# EAGLE design countdown (EAGLE 7.1.0)
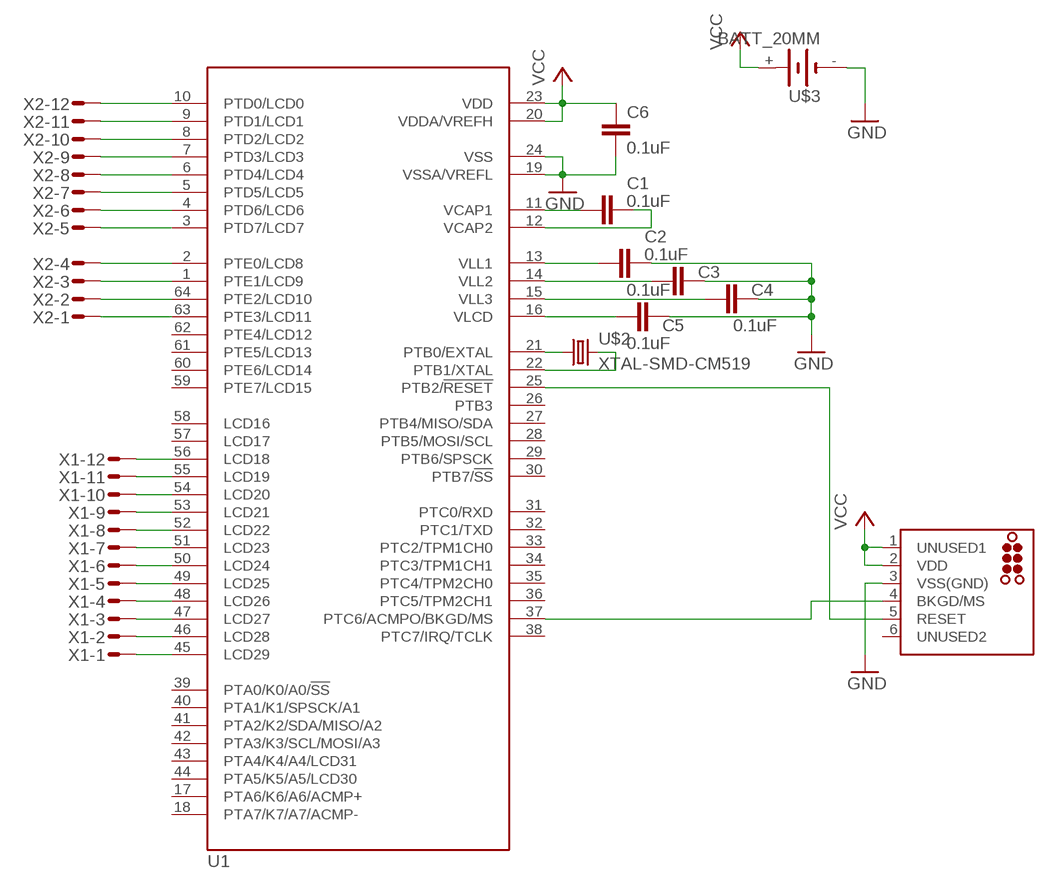
[diagram p0: schematic, sheet 1]

## Parts
BDM  TC2030-MCP-NL  [TC2030-MCP-NL]
C1  0.1uF  C-EUC0603K  [C0603K]
C2  0.1uF  C-EUC0603K  [C0603K]
C3  0.1uF  C-EUC0603K  [C0603K]
C4  0.1uF  C-EUC0603K  [C0603K]
C5  0.1uF  C-EUC0603K  [C0603K]
C6  0.1uF  C-EUC0603K  [C0603K]
U1  MC9S08LL16  [LQFP64]
U$2  XTAL-SMD-CM519  [SMD-XTAL-CM519]
U$3  BATT_20MM  [BATT_20MM]
X1-  HEADER-12-EDGE  [HEADER-12-EDGE]
X2-  HEADER-12-EDGE  [HEADER-12-EDGE]

## Nets
GND: BDM.3(VSS(GND)) C2.1 C3.1 C4.1 C5.1 C6.2 U1.19(VSSA/VREFL) U1.24(VSS) U$3.-
N$1: U1.63(PTE3/LCD11) X2-.1
N$2: U1.64(PTE2/LCD10) X2-.2
N$3: U1.1(PTE1/LCD9) X2-.3
N$4: U1.2(PTE0/LCD8) X2-.4
N$5: U1.3(PTD7/LCD7) X2-.5
N$6: U1.4(PTD6/LCD6) X2-.6
N$7: U1.5(PTD5/LCD5) X2-.7
N$8: U1.6(PTD4/LCD4) X2-.8
N$9: U1.7(PTD3/LCD3) X2-.9
N$10: U1.8(PTD2/LCD2) X2-.10
N$11: U1.9(PTD1/LCD1) X2-.11
N$12: U1.10(PTD0/LCD0) X2-.12
N$13: U1.45(LCD29) X1-.1
N$14: U1.46(LCD28) X1-.2
N$15: U1.47(LCD27) X1-.3
N$16: U1.48(LCD26) X1-.4
N$17: U1.49(LCD25) X1-.5
N$18: U1.50(LCD24) X1-.6
N$19: U1.51(LCD23) X1-.7
N$20: U1.52(LCD22) X1-.8
N$21: U1.53(LCD21) X1-.9
N$22: U1.54(LCD20) X1-.10
N$23: U1.55(LCD19) X1-.11
N$24: U1.56(LCD18) X1-.12
N$31: C1.2 U1.11(VCAP1)
N$32: C1.1 U1.12(VCAP2)
N$33: C2.2 U1.13(VLL1)
N$34: C3.2 U1.14(VLL2)
N$35: C4.2 U1.15(VLL3)
N$36: C5.2 U1.16(VLCD)
N$37: U1.21(PTB0/EXTAL) U$2.P$1
N$38: U1.22(PTB1/XTAL) U$2.P$2
N$39: BDM.4(BKGD/MS) U1.37(PTC6/ACMPO/BKGD/MS)
N$40: BDM.5(RESET) U1.25(PTB2/!RESET)
VCC: BDM.1(UNUSED1) BDM.2(VDD) C6.1 U1.20(VDDA/VREFH) U1.23(VDD) U$3.+
Unconnected: BDM.6(UNUSED2) U1.17(PTA6/K6/A6/ACMP+) U1.18(PTA7/K7/A7/ACMP-) U1.26(PTB3) U1.27(PTB4/MISO/SDA) U1.28(PTB5/MOSI/SCL) U1.29(PTB6/SPSCK) U1.30(PTB7/!SS) U1.31(PTC0/RXD) U1.32(PTC1/TXD) U1.33(PTC2/TPM1CH0) U1.34(PTC3/TPM1CH1) U1.35(PTC4/TPM2CH0) U1.36(PTC5/TPM2CH1) U1.38(PTC7/IRQ/TCLK) U1.39(PTA0/K0/A0/!SS) U1.40(PTA1/K1/SPSCK/A1) U1.41(PTA2/K2/SDA/MISO/A2) U1.42(PTA3/K3/SCL/MOSI/A3) U1.43(PTA4/K4/A4/LCD31) U1.44(PTA5/K5/A5/LCD30) U1.57(LCD17) U1.58(LCD16) U1.59(PTE7/LCD15) U1.60(PTE6/LCD14) U1.61(PTE5/LCD13) U1.62(PTE4/LCD12)

## Library data of the parts
BDM = scott:TC2030: TAG-CONNECT ISP Connector Manufacturer: Tag-Connect <www.tag-connect.com> Cable for easy In-Circuit PCB Programming. Designed for Microchip ICD2, suitable for many others. Two variants - one "with legs" (for hads-free fit on PCB) and another "without legs" for quick programming. PAD Description 1 MCLR/Vpp 2 Vdd 3 GND 4 PGD (ISPDAT) 5 PGC (ISPCLK) 6 nc (used for LVP) ©2009 ROFA.cz
C1-C6 = rcl:C-EU: CAPACITOR, European symbol
U1 = scott:MC9S08LL16
U$2 = scott:XTAL-SMD-CM519
U$3 = scott:BATT_20MM
X1- X2- = scott:HEADER-12-EDGE

## Board
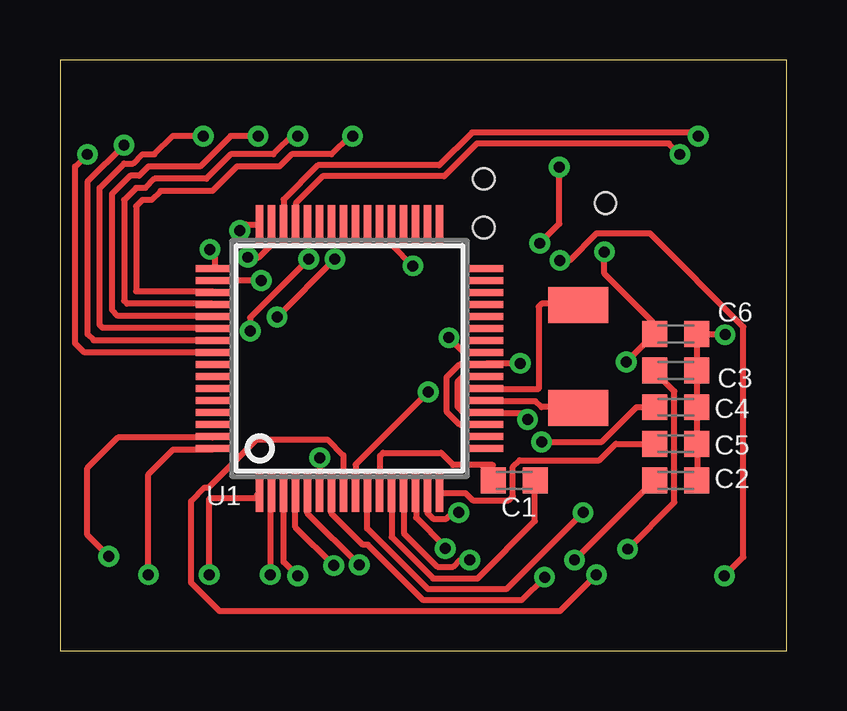
[diagram p1: board, top side]
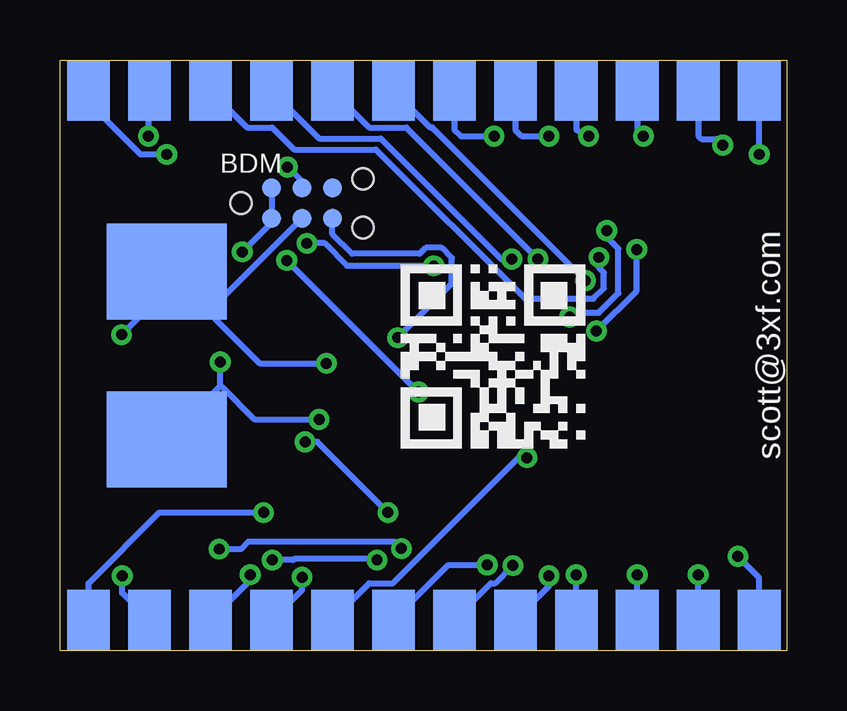
[diagram p2: board, bottom side, seen from below]

Size 30.28 x 24.63 mm. Coordinates in mm from the lower left corner, seen from the top.
Outline: 0,0 30.28,0 30.28,24.63 0,24.63 0,0
Copper layers (1*16): Top 0.035mm / dielectric 1.5mm / Bottom 0.035mm
Design rules "default *": minimum track width 10mil, minimum drill 18mil, track to track 8mil, track to pad 6mil, pad to pad 6mil, via to via 8mil, smd to smd 6mil, copper to edge 20mil, drill to drill 8mil, minimum pad ring 10mil, minimum via ring 8mil, stop-mask expansion 4mil, vias tented up to drill 0mil, thermal gap 10mil

### Footprints (pad centres in the part's own frame; a part is rotated, then mirrored left to right if it is on the bottom)
TC2030-MCP-NL = smd 0.787 x 0.787: 1 1.27,-0.635; 2 1.27,0.635; 3 2.54,-0.635; 4 2.54,0.635; 5 3.81,-0.635; 6 3.81,0.635 | hole 0.889: 0,0; 5.08,-1.016; 5.08,1.016
C0603K = smd 1.05 x 1.08: 1 -0.875,0; 2 0.875,0
LQFP64 = smd 0.3 x 1.6: 1 -3.75,-5.6; 2 -3.25,-5.6; 3 -2.75,-5.6; 4 -2.25,-5.6; 5 -1.75,-5.6; 6 -1.25,-5.6; 7 -0.75,-5.6; 8 -0.25,-5.6; 9 0.25,-5.6; 10 0.75,-5.6; 11 1.25,-5.6; 12 1.75,-5.6; 13 2.25,-5.6; 14 2.75,-5.6; 15 3.25,-5.6; 16 3.75,-5.6; 33 3.75,5.6; 34 3.25,5.6; 35 2.75,5.6; 36 2.25,5.6; 37 1.75,5.6; 38 1.25,5.6; 39 0.75,5.6; 40 0.25,5.6; 41 -0.25,5.6; 42 -0.75,5.6; 43 -1.25,5.6; 44 -1.75,5.6; 45 -2.25,5.6; 46 -2.75,5.6; 47 -3.25,5.6; 48 -3.75,5.6 | smd 1.6 x 0.3: 17 5.6,-3.75; 18 5.6,-3.25; 19 5.6,-2.75; 20 5.6,-2.25; 21 5.6,-1.75; 22 5.6,-1.25; 23 5.6,-0.75; 24 5.6,-0.25; 25 5.6,0.25; 26 5.6,0.75; 27 5.6,1.25; 28 5.6,1.75; 29 5.6,2.25; 30 5.6,2.75; 31 5.6,3.25; 32 5.6,3.75; 49 -5.6,3.75; 50 -5.6,3.25; 51 -5.6,2.75; 52 -5.6,2.25; 53 -5.6,1.75; 54 -5.6,1.25; 55 -5.6,0.75; 56 -5.6,0.25; 57 -5.6,-0.25; 58 -5.6,-0.75; 59 -5.6,-1.25; 60 -5.6,-1.75; 61 -5.6,-2.25; 62 -5.6,-2.75; 63 -5.6,-3.25; 64 -5.6,-3.75
SMD-XTAL-CM519 = smd 1.5 x 2.5: P$1 2.2,0; P$2 -2.1,0
BATT_20MM = smd 5 x 4: + 13,3.5; - 13,-3.5
HEADER-12-EDGE = smd 1.778 x 2.54 bottom: 1 -16.51,0.635; 2 -13.97,0.635; 3 -11.43,0.635; 4 -8.89,0.635; 5 -6.35,0.635; 6 -3.81,0.635; 7 -1.27,0.635; 8 1.27,0.635; 9 3.81,0.635; 10 6.35,0.635; 11 8.89,0.635; 12 11.43,0.635

### Placement (x,y rotation side)
BDM  22.73,18.67 0 bottom
C1  18.92,7.11 180 top
C2  25.65,7.11 180 top
C3  25.65,11.68 180 top
C4  25.65,10.16 180 top
C5  25.65,8.64 180 top
C6  25.65,13.21 0 top
U1  12.06,12.19 0 top
U$1  [QR-CODE-L-MED]  16.26,8.25 0 bottom
U$2  21.59,12.32 270 top
U$3  12.83,12.32 180 bottom
X1-  12.57,24 180 top
X2-  17.65,0.64 0 top

### Tracks (layer width: path | path; a pad name or v marks a point on that pad's centre or on a via)
GND  (via drill 0.46)
  Top 0.254: C2.1 26.54,7.11 26.54,8.64 C5.1 26.54,8.74 26.54,10.16 C4.1 26.54,10.26 26.54,11.68 C3.1 26.54,11.79 26.54,13.21 C6.2 26.64,13.18 v27.71,13.18 | U1.19 17.65,9.45 16.64,9.45 16.1,9.98 16.1,11.4 16.64,11.94 17.65,11.94 U1.24 17.78,11.99 v19.18,11.99
  Bottom 0.254: v19.18,11.99 21.95,11.99 25.7,15.75 U$3.- | v27.71,13.18 25.5,15.39 U$3.- | BDM.3 24,14.22 U$3.-
N$1  (via drill 0.46)
  Top 0.254: U1.63 6.35,8.89 2.41,8.89 1.14,7.62 1.14,4.83 v2.03,3.94
  Bottom 0.254: v2.03,3.94 1.14,3.05 X2-.1
N$2  (via drill 0.46)
  Top 0.254: U1.64 6.35,8.38 4.7,8.38 3.68,7.37 v3.68,3.18
  Bottom 0.254: X2-.2 v3.68,3.18
N$3  (via drill 0.46)
  Top 0.254: 8.25,6.35 8.18,6.35 | 8.18,6.35 6.22,6.35 v6.22,3.18 | U1.1 8.31,6.58 8.18,6.45 8.18,6.35
  Bottom 0.254: X2-.3 v6.22,3.18
N$4  (via drill 0.46)
  Top 0.254: v8.76,3.18 8.76,6.48 U1.2
  Bottom 0.254: X2-.4 v8.76,3.18
N$5  (via drill 0.46)
  Top 0.254: v9.91,3.12 9.32,3.71 9.32,6.58 U1.3
  Bottom 0.254: v9.91,3.12 9.91,2.69 11.3,1.3 X2-.5
N$6  (via drill 0.46)
  Top 0.254: v11.4,3.56 9.8,5.16 9.8,6.58 U1.4
  Bottom 0.254: v11.4,3.56 12.14,2.82 12.32,2.82 13.84,1.3 X2-.6
N$7  (via drill 0.46)
  Top 0.254: v12.47,3.58 10.31,5.74 10.31,6.58 U1.5
  Bottom 0.254: v12.47,3.58 14.1,3.58 16.38,1.3 X2-.7
N$8  (via drill 0.46)
  Top 0.254: v10.82,8.05 10.82,6.6 U1.6
  Bottom 0.254: v10.82,8.05 11.18,8.05 16.41,2.82 17.4,2.82 18.92,1.3 X2-.8
N$9  (via drill 0.46)
  Top 0.254: v20.19,3.07 19.23,2.11 15.14,2.11 12.83,4.42 12.62,4.42 11.3,5.74 11.3,6.53 11.33,6.55 11.33,6.58 U1.7
  Bottom 0.254: v20.19,3.07 20.19,2.54 X2-.9
N$10  (via drill 0.46)
  Top 0.254: v22.35,3.18 20.83,1.65 6.65,1.65 5.46,2.85 5.46,6.25 6.02,6.81 6.2,6.81 8.2,8.81 11.15,8.81 11.81,8.15 11.81,6.6 U1.8
  Bottom 0.254: v22.35,3.18 22.35,2.95 24,1.3 X2-.10
N$11  (via drill 0.46)
  Top 0.254: v15.34,10.79 12.32,7.77 12.32,6.6 U1.9 | v20.83,16.28 21.23,16.28 22.35,17.4 24.59,17.4 28.47,13.51 28.47,3.91 v27.69,3.12
  Bottom 0.254: v20.83,16.28 v15.34,10.79 | v27.69,3.12 27.69,2.41 X2-.11
N$12  (via drill 0.46)
  Top 0.254: v21.79,5.77 18.59,2.56 15.34,2.56 12.8,5.11 12.8,6.58 U1.10
  Bottom 0.254: v21.79,5.77 26.14,5.77 29.08,2.82 X2-.12
N$13  (via drill 0.46)
  Top 0.254: v25.83,20.7 25.38,21.16 17.37,21.16 16,19.79 10.95,19.79 9.83,18.67 9.83,17.81 U1.45
  Bottom 0.254: v25.83,20.7 26.92,20.7 29.08,22.86 X1-.1
N$14  (via drill 0.46)
  Top 0.254: v26.59,21.46 26.44,21.62 17.17,21.62 15.8,20.24 10.74,20.24 9.32,18.82 9.32,17.81 U1.46
  Bottom 0.254: v26.59,21.46 26.59,23.32 X1-.2
N$15  (via drill 0.46)
  Top 0.254: v7.82,16.41 8.28,16.41 8.81,16.94 8.81,17.78 U1.47
  Bottom 0.254: v7.82,16.41 7.82,15.98 7.62,15.77 7.62,15.11 8.05,14.68 10.9,14.68 17.12,20.9 20.52,20.9 21.44,21.82 22.48,21.82 24,23.34 X1-.3
N$16  (via drill 0.46)
  Top 0.254: v7.49,17.53 7.75,17.78 8.31,17.78 U1.48 | v11.46,16.33 v9.04,13.92
  Bottom 0.254: v7.49,17.53 7.49,17.25 7.01,16.76 7.01,14.91 7.82,14.1 8.87,14.1 v9.04,13.92 | v11.46,16.33 11.89,16.33 16.92,21.36 19.48,21.36 21.46,23.34 X1-.4
N$17  (via drill 0.46)
  Top 0.254: v6.25,16.74 6.45,16.54 6.45,15.95 U1.49 | v7.92,13.33 7.92,13.89 v10.36,16.33
  Bottom 0.254: v6.25,16.74 6.25,15.01 v7.92,13.33 | v10.36,16.33 15.85,21.82 17.4,21.82 18.92,23.34 X1-.5
N$18  (via drill 0.46)
  Top 0.254: v8.38,15.44 U1.50
  Bottom 0.254: v8.38,15.44 14.76,21.82 14.86,21.82 16.38,23.34 X1-.6
N$19  (via drill 0.46)
  Top 0.254: 12.06,21.59 v12.19,21.46 12.06,21.46 11.3,20.7 9.65,20.7 9.14,20.19 7.37,20.19 6.35,19.18 4.19,19.18 3.81,18.8 3.43,18.8 3.18,18.54 3.18,14.99 6.35,14.99 U1.51
  Bottom 0.254: v12.19,21.46 13.59,21.46 13.84,21.72 X1-.7
N$20  (via drill 0.46)
  Top 0.254: U1.52 6.35,14.48 2.79,14.48 2.67,14.6 2.67,18.8 3.18,19.3 3.56,19.3 3.94,19.69 6.1,19.69 7.11,20.7 8.89,20.7 9.78,21.59 v9.91,21.46
  Bottom 0.254: v9.91,21.46 11.05,21.46 11.3,21.72 X1-.8
N$21  (via drill 0.46)
  Top 0.254: U1.53 6.35,13.97 2.41,13.97 2.16,14.22 2.16,19.05 2.92,19.81 3.3,19.81 3.68,20.19 5.84,20.19 7.11,21.46 v8.25,21.46
  Bottom 0.254: v8.25,21.46 8.76,21.72 X1-.9
N$22  (via drill 0.46)
  Top 0.254: U1.54 6.35,13.46 1.78,13.46 1.65,13.59 1.65,19.3 2.67,20.32 3.05,20.32 3.43,20.7 3.94,20.7 4.7,21.46 v5.97,21.46
  Bottom 0.254: v5.97,21.46 6.22,21.72 X1-.10
N$23  (via drill 0.46)
  Top 0.254: v2.67,21.08 1.14,19.56 1.14,13.21 1.4,12.95 6.45,12.95 U1.55
  Bottom 0.254: X1-.11 3.68,21.46 3.56,21.34 2.92,21.34 v2.67,21.08
N$24  (via drill 0.46)
  Top 0.254: U1.56 1.27,12.45 1.02,12.44 0.64,12.82 0.64,20.19 v1.14,20.7
  Bottom 0.254: v1.14,20.7 X1-.12
N$31
  Top 0.254: U1.11 13.33,6.6 13.33,8.13 13.46,8.25 15.88,8.25 16.38,7.75 18.03,7.75 18.03,7.11 C1.2
N$32
  Top 0.254: C1.1 19.79,5.41 17.4,3.02 15.54,3.02 13.82,4.75 13.82,6.58 U1.12
N$33  (via drill 0.46)
  Top 0.254: v21.44,3.79 24.77,7.11 C2.2 | v17.07,3.79 16.66,3.79 16.38,3.51 15.72,3.51 14.33,4.9 14.33,6.58 U1.13
  Bottom 0.254: v21.44,3.79 20.57,3.79 20.52,3.84 17.12,3.84 v17.07,3.79
N$34  (via drill 0.46)
  Top 0.254: v23.65,4.24 25.6,6.2 25.6,10.82 24.79,11.63 24.79,11.68 C3.2 | v16.05,4.27 16.05,4.34 14.83,5.56 14.83,6.58 U1.14
  Bottom 0.254: v23.65,4.24 22.73,4.24 22.43,4.55 16.33,4.55 v16.05,4.27
N$35  (via drill 0.46)
  Top 0.254: C4.2 24.03,10.16 22.58,8.71 v20.07,8.71 | v16.61,5.77 16.36,5.77 16.1,5.51 15.54,5.51 15.32,5.74 15.32,6.58 U1.15
  Bottom 0.254: v20.07,8.71 19.56,8.71 v16.61,5.77
N$36
  Top 0.254: C5.2 23.16,8.64 22.48,7.95 19.15,7.95 18.87,7.67 18.87,6.45 18.69,6.27 17.2,6.27 16.89,6.58 15.82,6.58 U1.16
N$37
  Top 0.254: U1.21 17.78,10.41 19.81,10.41 20.07,10.16 21.59,10.16 U$2.P$1
N$38
  Top 0.254: U1.22 17.78,10.92 19.94,10.92 19.94,14.35 20.07,14.48 21.59,14.48 U$2.P$2
N$39  (via drill 0.46)
  Top 0.254: v20.8,20.17 20.8,17.81 v19.99,16.99 | v14.71,16.05 13.82,16.94 13.82,17.78 U1.37
  Bottom 0.254: BDM.4 20.19,19.56 v20.8,20.17 | v19.99,16.99 19.25,16.99 18.31,16.05 v14.71,16.05
N$40  (via drill 0.46)
  Top 0.254: v16.2,13.06 16.82,12.45 17.65,12.45 U1.25
  Bottom 0.254: BDM.5 18.92,17.37 18.11,16.56 15.29,16.56 15.04,16.82 14.38,16.82 13.95,16.38 13.95,15.32 v16.2,13.06
VCC  (via drill 0.46)
  Top 0.254: U1.23 17.65,11.43 16.79,11.43 16.56,11.2 16.56,10.19 16.79,9.96 17.65,9.96 U1.20 17.78,9.91 19.23,9.91 v19.48,9.65 | v23.6,12.04 24.77,13.21 C6.1 24.69,13.31 24.69,13.72 22.68,15.72 v22.68,16.64
  Bottom 0.254: 23.6,11.05 v23.6,12.04 | 23.6,11.05 25.81,8.84 U$3.+ | v19.48,9.65 22.17,9.65 23.5,10.97 23.6,11.05 | BDM.2 BDM.1 21.54,17.93 21.54,17.78 v22.68,16.64

### Text on the board
bNames: scott@3xf.com
tValues: LCD mounted on top, pins wrapped around edges to bottom